# Altium schematic sheet IIC.SchDoc
size A4
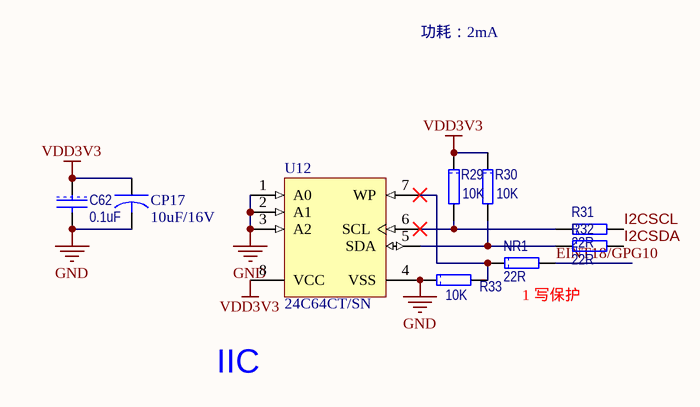
[diagram p0: IIC.SchDoc]

## Parts
C62  0.1uF  [1608[0603]]
CP17  10uF/16V  [3216[1206]]
NR1  22R  [1608[0603]R]
R29  10K  [1608[0603]R]
R30  10K  [1608[0603]R]
R31  22R  [1608[0603]R]
R32  22R  [1608[0603]R]
R33  10K  [1608[0603]R]
U12  24C64CT/SN  [SOIC8_N]

## Nets
GND: C62.2 CP17.2 R33.1 U12.1(A0) U12.2(A1) U12.3(A2) U12.4(VSS)
VDD3V3: C62.1 CP17.1 R29.1 R30.1 U12.8(VCC)
EINT18/GPG10: NR1.2
I2CSCL: R31.2
I2CSDA: R32.2
NetNR1_1: NR1.1 R33.2 U12.7(WP)
NetR29_2: R29.2 R31.1 U12.6(SCL)
NetR30_2: R30.2 R32.1 U12.5(SDA)

## Notes on the sheet
- 功耗：2mA
- (near NR1) 1 写保护
- (near U12) IIC

## Library data of the parts
C62 = CAP: Capacitor; Manufacturer: TDK; Type: 无铅电容; Model: C0603X7R1H104K; Value: 0.1uF
CP17 = CAPACITOR: Tantalum Capacitor
NR1 R31 R32 = RES: Manufacturer: vishay; Model: CRCW060322R0KKEDTR; Value: 22R; Type: 无铅电阻
R29 R30 = RES: Manufacturer: vishay; Model: CRCW060310K0KKEDTR; Value: 10K; Type: 无铅电阻
R33 = RES: Manufacturer: vishay; Model: CRCW060310K0KKEDTR; Parameters: 50V 1/10W 0.5%; Type: 无铅电阻; Value: 10K
U12 = 24C02CT/SN: IC; Published: 29-Jan-2009; DatasheetVersion: revJ, Aug-2008; PackageVersion: revBB, Aug-2009; PackageReference: SOIC-SN8; Publisher: Altium Limited; PackageDescription: 8-Lead Plastic Small Outline (SN) - Narrow, 3.90mm Body [SOIC]; Supplier 1: Digi-Key; Supplier Part Number 1: 24C02CT/SN-ND; Code_JEDEC: MS-012; Code_IPC: SOIC127P600-8; ComponentLink1Description: Datasheet; ComponentLink1URL: http://ww1.microchip.com/downloads/en/DeviceDoc/21202J.pdf; ComponentLink2Description: Packaging Specification; ComponentLink2URL: http://www.microchip.com/stellent/groups/techpub_sg/documents/packagingspec/en012702.pdf; ComponentLink3Description: Microchip.com Home; ComponentLink3URL: http://www.microchip.com/; Supplier 2: Newark; Supplier Part Number 2: 08R5417